# EAGLE design sound_board (EAGLE 5.10)
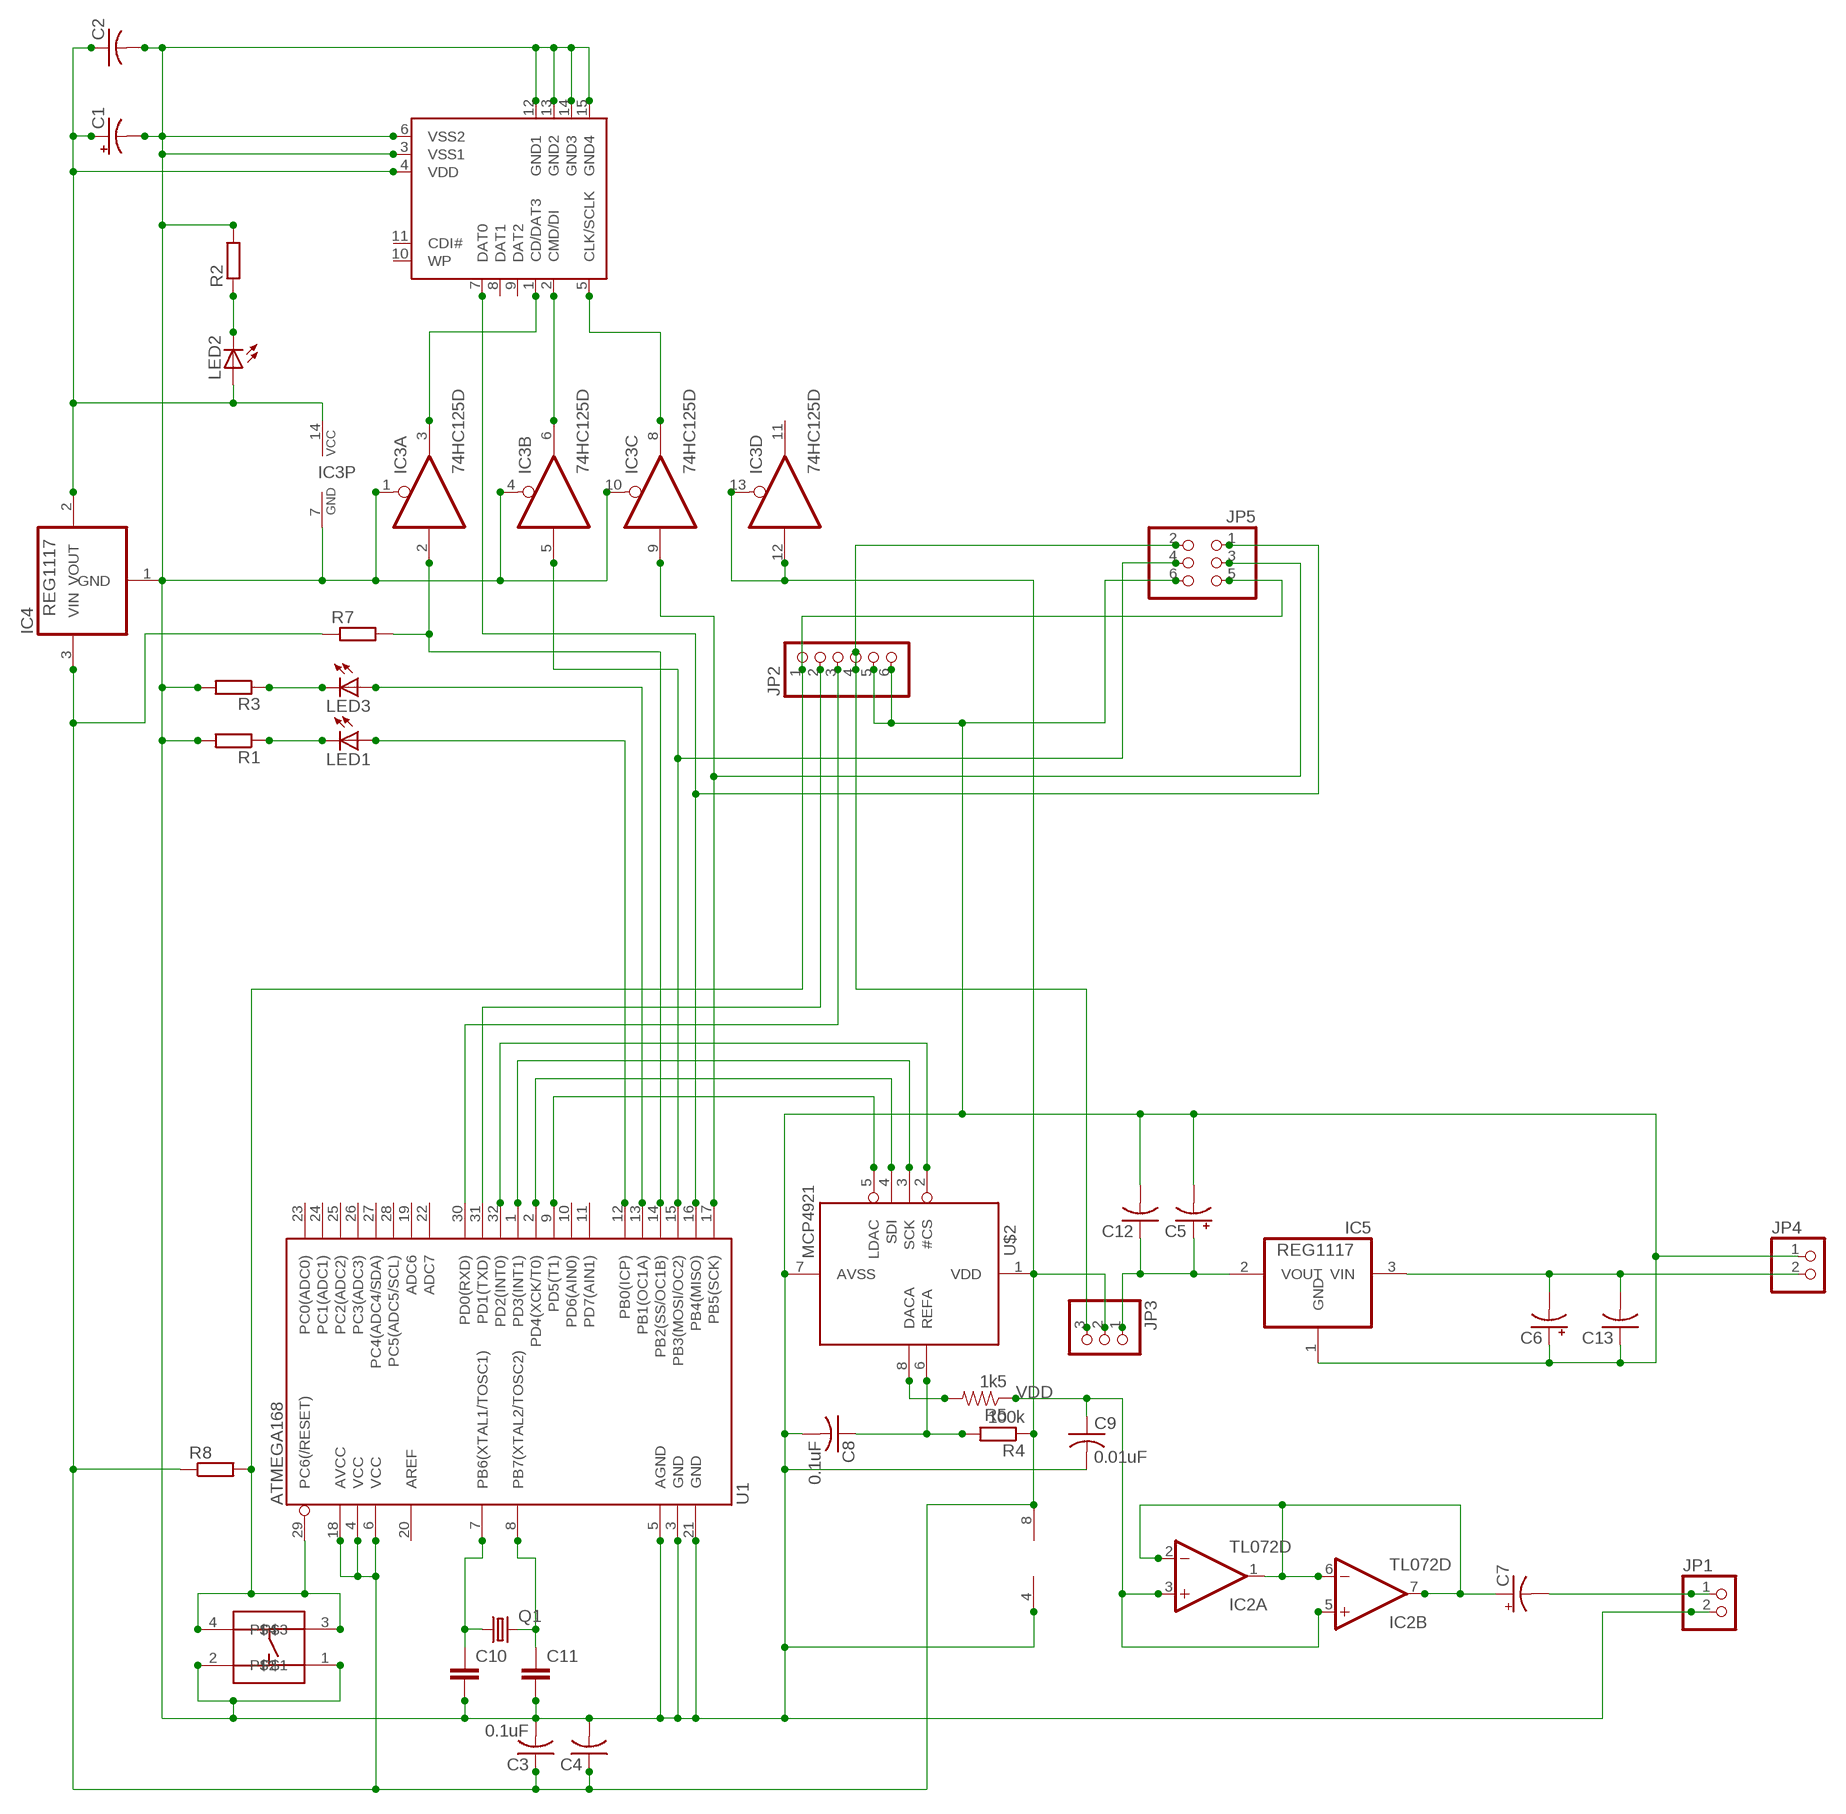
[diagram p0: schematic, sheet 1]

## Parts
C1  CPOL-US153CLV-0605  [153CLV-0605]
C2  C-USC0805  [C0805]
C3  0.1uF  C-USC0805  [C0805]
C4  C-USC0805  [C0805]
C5  CPOL-US153CLV-0605  [153CLV-0605]
C6  CPOL-US153CLV-0605  [153CLV-0605]
C7  CPOL-US153CLV-0810  [153CLV-0810]
C8  0.1uF  C-USC0805  [C0805]
C9  0.01uF  C-USC0805  [C0805]
C10  C-EUC0805  [C0805]
C11  C-EUC0805  [C0805]
C12  C-USC0805  [C0805]
C13  C-USC0805  [C0805]
IC2  TL072D  [SO08]
IC3  74HC125D  [SO14]
IC4  REG1117  [SOT223]
IC5  REG1117  [SOT223]
JP1  PINHD-1X2  [1X02]
JP2  PINHD-1X6  [1X06]
JP3  PINHD-1X3  [1X03]
JP4  PINHD-1X2  [1X02]
JP5  PINHD-2X3  [2X03]
LED1  LEDCHIP-LED0805  [CHIP-LED0805]
LED2  LEDCHIP-LED0805  [CHIP-LED0805]
LED3  LEDCHIP-LED0805  [CHIP-LED0805]
Q1  CRYSTAL10.5X4.8  [CRYSTAL-SMD-10.5X4.8-2PIN]
R1  R-EU_R0805  [R0805]
R2  R-EU_R0805  [R0805]
R3  R-EU_R0805  [R0805]
R4  100k  R-EU_R0805  [R0805]
R5  1k5  RESISTOR1206  [1206]
R7  R-EU_R0805  [R0805]
R8  R-EU_M0805  [M0805]
U1  ATMEGA168  [TQFP32-08]
U$1  SMD-TACT-SW  [SMD-TACT-SW]
U$2  MCP4921SMD  [SO08]
U$3  SD/MMCSD/MMC  [SD/MMC]

## Nets
3V3: C1.+ C2.1 IC3.14(P:VCC) IC4.2(VOUT) LED2.A U$3.4(VDD)
AVSS: C1.- C2.2 C3.2 C4.2 C5.- C6.+ C8.2 C9.2 C10.2 C11.2 C12.2 C13.1 IC2.4(P:V-) IC3.1(A:OE) IC3.4(B:OE) IC3.7(P:GND) IC3.10(C:OE) IC4.1(GND) IC5.1(GND) JP1.2 JP2.5 JP2.6 JP4.1 JP5.6 R1.2 R2.2 R3.2 U1.3(GND) U1.5(AGND) U1.21(GND) U$1.1 U$1.2 U$2.7(AVSS) U$3.3(VSS1) U$3.6(VSS2) U$3.12(GND1) U$3.13(GND2) U$3.14(GND3) U$3.15(GND4)
N$1: IC3.8(C:O) U$3.5(CLK/SCLK)
N$2: IC3.6(B:O) U$3.2(CMD/DI)
N$3: IC3.3(A:O) U$3.1(CD/DAT3)
N$5: IC3.2(A:I) R7.2 U1.14(PB2(SS/OC1B))
N$6: JP5.1 U1.16(PB4(MISO)) U$3.7(DAT0)
N$7: LED1.C R1.1
N$9: LED1.A U1.12(PB0(ICP))
N$10: JP2.3 U1.30(PD0(RXD))
N$11: C9.1 IC2.3(A:+IN) IC2.5(B:+IN) R5.1
N$12: LED2.C R2.1
N$13: C10.1 Q1.P$1 U1.7(PB6(XTAL1/TOSC1))
N$14: C7.+ IC2.1(A:OUT) IC2.2(A:-IN) IC2.6(B:-IN) IC2.7(B:OUT)
N$15: JP2.4 JP3.3 JP5.2
N$16: C7.- JP1.1
N$17: C8.1 R4.2 U$2.6(REFA)
N$18: R5.2 U$2.8(DACA)
N$19: LED3.C R3.1
N$20: IC3.5(B:I) JP5.4 U1.15(PB3(MOSI/OC2))
N$21: LED3.A U1.13(PB1(OC1A))
N$22: U1.32(PD2(INT0)) U$2.2(#CS)
N$23: U1.1(PD3(INT1)) U$2.3(SCK)
N$24: U1.2(PD4(XCK/T0)) U$2.4(SDI)
N$25: U1.9(PD5(T1)) U$2.5(LDAC)
N$26: C11.1 Q1.P$2 U1.8(PB7(XTAL2/TOSC2))
N$27: JP2.2 U1.31(PD1(TXD))
N$28: JP2.1 JP5.5 R8.2 U1.29(PC6(/RESET)) U$1.3 U$1.4
N$29: C5.+ C12.1 IC5.2(VOUT) JP3.1
N$32: IC3.9(C:I) JP5.3 U1.17(PB5(SCK))
N$41: C6.- C13.2 IC5.3(VIN) JP4.2
VDD: C3.1 C4.1 IC2.8(P:V+) IC3.12(D:I) IC3.13(D:OE) IC4.3(VIN) JP3.2 R4.1 R7.1 R8.1 U1.4(VCC) U1.6(VCC) U1.18(AVCC) U$2.1(VDD)
Unconnected: IC3.11(D:O) U1.10(PD6(AIN0)) U1.11(PD7(AIN1)) U1.19(ADC6) U1.20(AREF) U1.22(ADC7) U1.23(PC0(ADC0)) U1.24(PC1(ADC1)) U1.25(PC2(ADC2)) U1.26(PC3(ADC3)) U1.27(PC4(ADC4/SDA)) U1.28(PC5(ADC5/SCL)) U$3.8(DAT1) U$3.9(DAT2) U$3.10(WP) U$3.11(CDI#)

## Library data of the parts
C1 C5-C7 = adafruit:CPOL-US: POLARIZED CAPACITOR, American symbol
C2-C4 C8 C9 C12 C13 = adafruit:C-US: CAPACITOR, American symbol
C10 C11 = rcl:C-EU: CAPACITOR, European symbol
IC2 = linear:TL072: OP AMP
IC3 = 74xx-eu:74*125: Quad bus BUFFER, 3-state
IC4 IC5 = burr-brown:REG1117: 800mA and 1A Low Dropout (LDO) Positive Regulator 1.8V, 2.5V, 2.85V, 3.3V, 5V, and Adj
JP1 JP4 = pinhead:PINHD-1X2: PIN HEADER
JP2 = adafruit:PINHD-1X6: PIN HEADER
JP3 = adafruit:PINHD-1X3: PIN HEADER
JP5 = pinhead:PINHD-2X3: PIN HEADER
LED1-LED3 = adafruit:LED: LED OSRAM: - CHIPLED LG R971, LG N971, LY N971, LG Q971, LY Q971, LO R971, LY R971 LH N974, LH R974 LS Q976, LO Q976, LY Q976 LO Q996 - Hyper CHIPLED LW Q18S LB Q993, LB Q99A, LB R99A - SideLED LS A670, LO A670, LY A670, LG A670, LP A670 LB A673, LV A673, LT A673, LW A673 LH A674 LY A675 LS A676, LA A676, LO A676, LY A676, LW A676 LS A679, LY A679, LG A679 - Hyper Micro SIDELED® LS Y876, LA Y876, LO Y876, LY Y876 LT Y87S - SmartLED LW L88C, LW L88S LB L89C, LB L89S, LG L890 LS L89K, LO L89K, LY L89K LS L896, LA L896, LO L896, LY L896 - TOPLED LS T670, LO T670, LY T670, LG T670, LP T670 LSG T670, LSP T670, LSY T670, LOP T670, LYG T670 LG T671, LOG T671, LSG T671 LB T673, LV T673, LT T673, LW T673 LH T674 LS T676, LA T676, LO T676, LY T676, LB T676, LH T676, LSB T676, LW T676 LB T67C, LV T67C, LT T67C, LS T67K, LO T67K, LY T67K, LW E67C LS E67B, LA E67B, LO E67B, LY E67B, LB E67C, LV E67C, LT E67C LW T67C LS T679, LY T679, LG T679 LS T770, LO T770, LY T770, LG T770, LP T770 LB T773, LV T773, LT T773, LW T773 LH T774 LS E675, LA E675, LY E675, LS T675 LS T776, LA T776, LO T776, LY T776, LB T776 LHGB T686 LT T68C, LB T68C - Hyper Mini TOPLED® LB M676 - Mini TOPLED Santana® LG M470 LS M47K, LO M47K, LY M47K Source: http://www.osram.convergy.de/
Q1 = SparkFun:CRYSTAL: Crystals Various standard crystals. Proven footprints. Spark Fun Electronics SKU : COM-00534
R1-R4 R7 = resistor:R-EU_: RESISTOR, European symbol
R5 = SparkFun:RESISTOR: Resistor Basic schematic elements and footprints for 0603, 1206, and PTH 1/10th watt (small) resistors.
R8 = rcl:R-EU_: RESISTOR, European symbol
U1 = SparkFun:ATMEGA168
U$1 = jasons_stuff:SMD-TACT-SW
U$2 = jasons_stuff:MCP4921
U$3 = jasons_stuff:SD/MMC: SD card connector KINGFONT SDCMF-10915W010

## Board
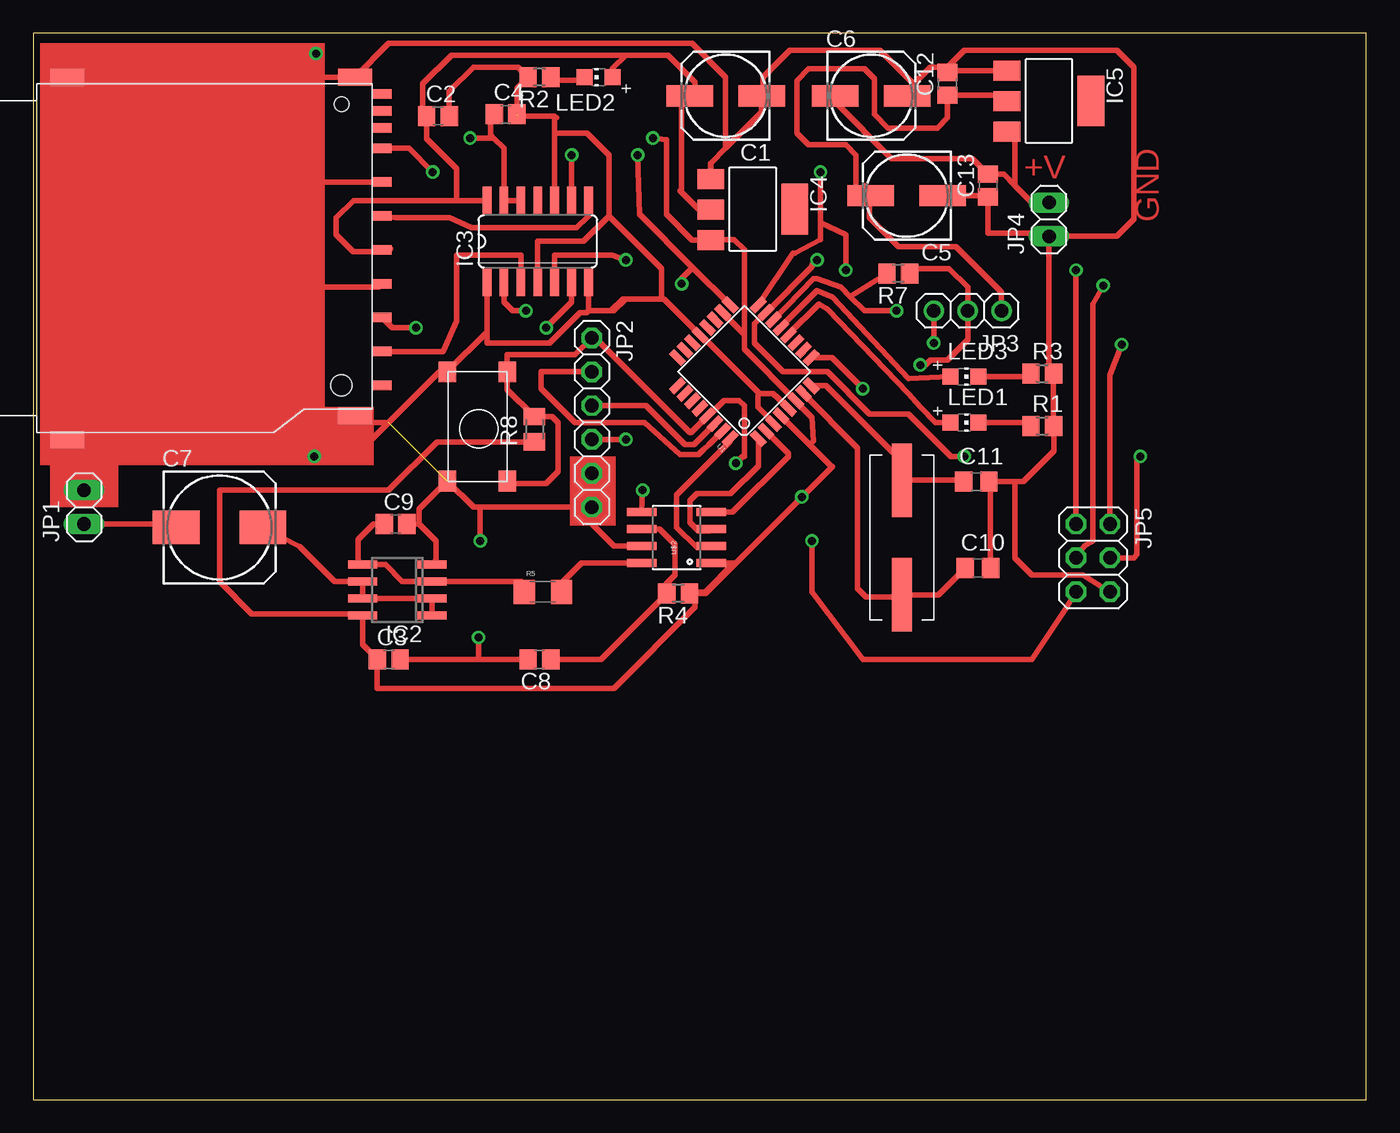
[diagram p1: board, top side]
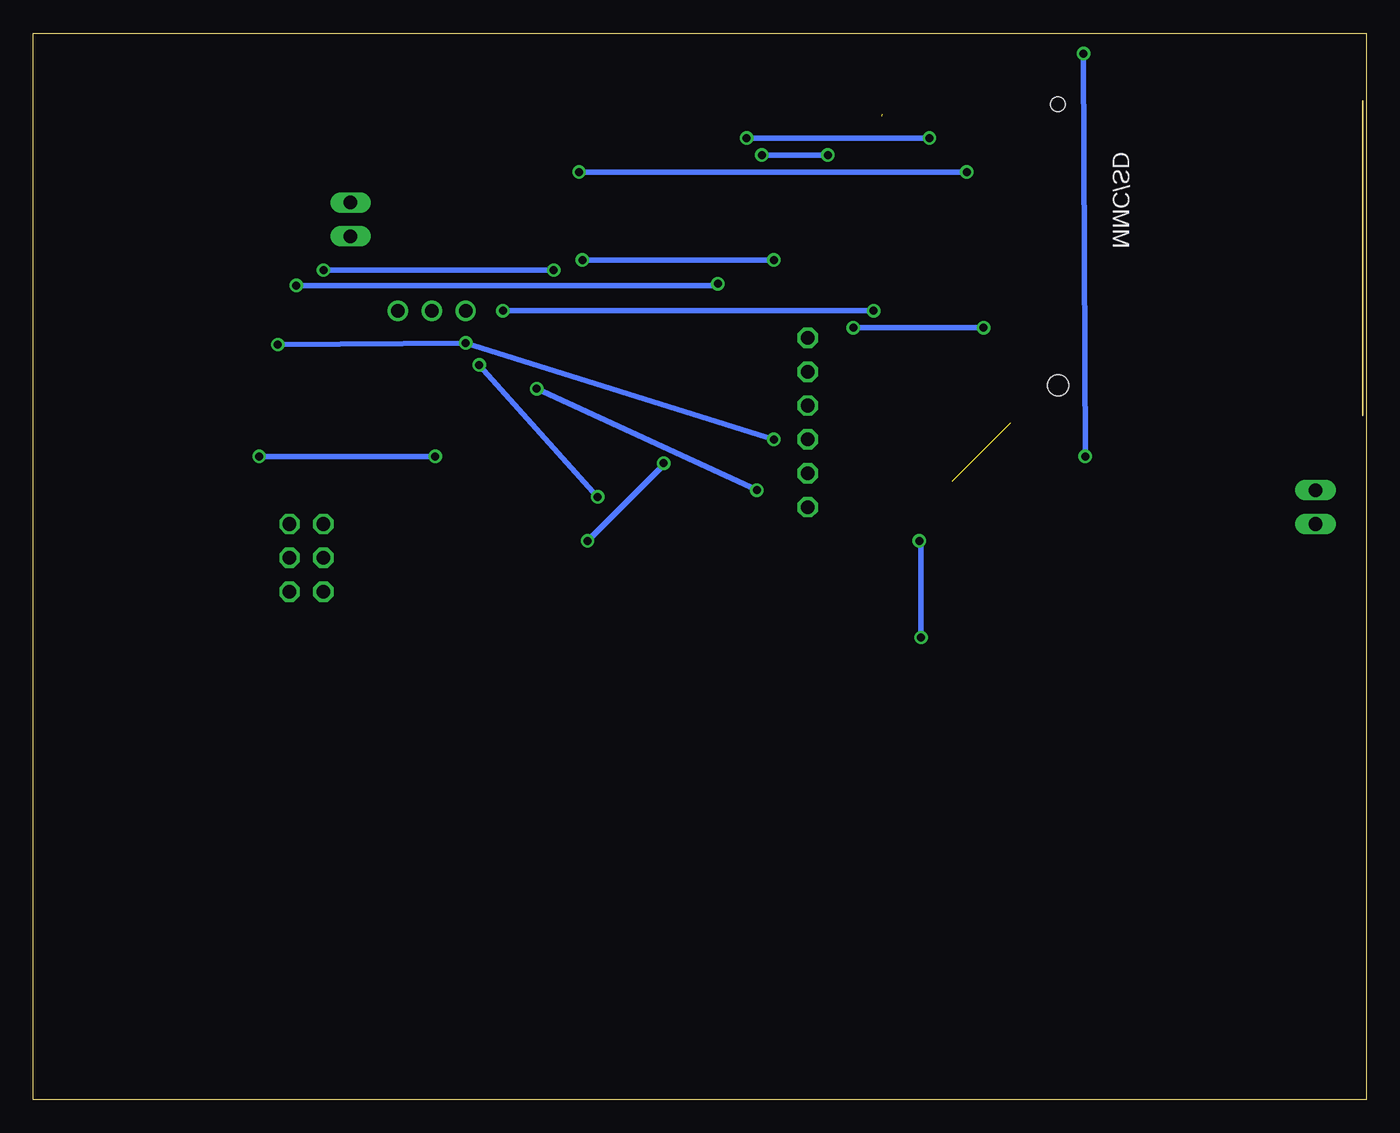
[diagram p2: board, bottom side, seen from below]

Size 100 x 80 mm. Coordinates in mm from the lower left corner, seen from the top.
Outline: 0,0 100,0 100,80 0,80 0,0
Copper layers (1*16): Top 0.035mm / dielectric 1.5mm / Bottom 0.035mm
Design rules "default": minimum track width 10mil, minimum drill 24mil, track to track 8mil, track to pad 8mil, pad to pad 8mil, via to via 8mil, smd to smd 8mil, copper to edge 40mil, drill to drill 8mil, minimum pad ring 10mil, minimum via ring 8mil, stop-mask expansion 4mil, vias tented up to drill 0mil, thermal gap 10mil

### Footprints (pad centres in the part's own frame; a part is rotated, then mirrored left to right if it is on the bottom)
153CLV-0605 = smd 3.5 x 1.6: + 2.7,0; - -2.7,0
C0805 = smd 1.3 x 1.5: 1 -0.85,0; 2 0.85,0
153CLV-0810 = smd 3.5 x 2.5: + 3.25,0; - -3.25,0
C0805' = smd 1.3 x 1.5: 1 -0.95,0; 2 0.95,0
SO08 = smd 0.6 x 2.2: 1 -1.905,-2.6; 2 -0.635,-2.6; 3 0.635,-2.6; 4 1.905,-2.6; 5 1.905,2.6; 6 0.635,2.6; 7 -0.635,2.6; 8 -1.905,2.6
SO14 = smd 0.66 x 2.032: 1 -3.81,-3.073; 2 -2.54,-3.073; 3 -1.27,-3.073; 4 0,-3.073; 5 1.27,-3.073; 6 2.54,-3.073; 7 3.81,-3.073; 8 3.81,3.073; 9 2.54,3.073; 10 1.27,3.073; 11 0,3.073; 12 -1.27,3.073; 13 -2.54,3.073; 14 -3.81,3.073
SOT223 = smd 1.499 x 2.007: 1 -2.261,-3.15; 2 0.025,-3.15; 3 2.311,-3.15 | smd 3.81 x 2.007: 4 0,3.15
1X02 = drill 1.016 long: 1 -1.27,0; 2 1.27,0
1X06 = drill 1.016 octagon: 1 -6.35,0; 2 -3.81,0; 3 -1.27,0; 4 1.27,0; 5 3.81,0; 6 6.35,0
1X03 = drill 1.016 round: 1 -2.54,0; 2 0,0; 3 2.54,0
2X03 = drill 1.016 octagon: 1 -2.54,-1.27; 2 -2.54,1.27; 3 0,-1.27; 4 0,1.27; 5 2.54,-1.27; 6 2.54,1.27
CHIP-LED0805 = smd 1.2 x 1.2: A 0,-1.05; C 0,1.05
CRYSTAL-SMD-10.5X4.8-2PIN = smd 5.5 x 1.5: P$1 -4.3,0; P$2 4.3,0
R0805 = smd 1.3 x 1.5: 1 -0.85,0; 2 0.85,0
1206 = smd 1.6 x 1.8: 1 -1.4,0; 2 1.4,0
M0805 = smd 1.3 x 1.6: 1 -0.95,0; 2 0.95,0
TQFP32-08 = smd 1.27 x 0.559: 1 -4.293,2.8; 2 -4.293,2; 3 -4.293,1.2; 4 -4.293,0.4; 5 -4.293,-0.4; 6 -4.293,-1.2; 7 -4.293,-2; 8 -4.293,-2.8; 17 4.293,-2.8; 18 4.293,-2; 19 4.293,-1.2; 20 4.293,-0.4; 21 4.293,0.4; 22 4.293,1.2; 23 4.293,2; 24 4.293,2.8 | smd 0.559 x 1.27: 9 -2.8,-4.293; 10 -2,-4.293; 11 -1.2,-4.293; 12 -0.4,-4.293; 13 0.4,-4.293; 14 1.2,-4.293; 15 2,-4.293; 16 2.8,-4.293; 25 2.8,4.293; 26 2,4.293; 27 1.2,4.293; 28 0.4,4.293; 29 -0.4,4.293; 30 -1.2,4.293; 31 -2,4.293; 32 -2.8,4.293
SMD-TACT-SW = smd 1.55 x 1.3: 1 8.2,-4.5; 2 0,-4.5; 3 8.2,0; 4 0,0
SO08' = smd 0.61 x 2.21: 1 -1.905,-2.616; 2 -0.635,-2.616; 3 0.635,-2.616; 4 1.905,-2.616; 5 1.905,2.616; 6 0.635,2.616; 7 -0.635,2.616; 8 -1.905,2.616
SD/MMC = smd 0.711 x 1.422: 1 7.366,13.462; 2 4.826,13.462; 3 2.286,13.462; 4 -0.254,13.462; 5 -2.794,13.462; 6 -5.334,13.462; 7 -7.874,13.462; 8 -9.398,13.462; 9 9.906,13.462; 10 -11.938,13.462; 11 -10.668,13.462 | smd 1.27 x 2.54: 12 12.192,11.43; 13 13.97,-10.16; 14 -13.208,-10.16; 15 -13.208,11.43 | hole 1.6: 9.906,10.414 | hole 1.1: -11.176,10.414

### Placement (x,y rotation side)
C1  51.94,75.31 180 top
C2  30.35,73.79 0 top
C3  26.67,33.02 0 top
C4  35.43,73.91 0 top
C5  65.53,67.82 180 top
C6  62.87,75.31 0 top
C7  13.97,42.93 0 top
C8  37.97,33.02 180 top
C9  27.18,43.18 0 top
C10  [C0805']  70.87,39.88 0 top
C11  [C0805']  70.74,46.35 0 top
C12  68.58,76.2 90 top
C13  71.63,68.58 90 top
IC2  27.3,38.23 90 top
IC3  37.85,64.39 0 top
IC4  53.98,66.8 270 top
IC5  76.2,74.93 270 top
JP1  3.81,44.45 90 top
JP2  41.91,50.8 270 top
JP3  70.1,59.18 180 top
JP4  76.2,66.04 90 top
JP5  79.5,40.64 270 top
LED1  69.85,50.8 270 top
LED2  42.42,76.71 90 top
LED3  69.85,54.23 270 top
Q1  65.15,42.16 90 top
R1  75.69,50.55 0 top
R2  37.97,76.71 180 top
R3  75.69,54.48 0 top
R4  48.39,37.97 180 top
R5  38.23,38.1 0 top
R7  64.9,61.98 180 top
R8  37.59,50.29 90 top
U1  53.34,54.61 135 top
U$1  35.56,54.61 270 top
U$2  MCP4921SMD  [SO08']  48.26,42.16 90 top
U$3  12.7,63.5 270 top

### Tracks (layer width: path | path; a pad name or v marks a point on that pad's centre or on a via)
3V3
  Top 0.406: IC4.2 50.8,66.8 49.91,66.8 48.51,68.2 48.64,68.33 48.64,74.93 49.02,75.31 C1.+ 49.66,75.72 49.66,76.33 47.62,78.36 44.45,78.36 | U$3.4 26.25,63.84 26.8,63.84 26.58,63.63 24,63.63 22.73,64.9 22.73,66.17 24.03,67.46 31.75,67.46 | 44.45,78.36 31.37,78.36 29.21,76.2 29.21,74.08 C2.1 29.5,72.1 31.75,69.85 31.75,67.46 | LED2.A 43.47,77.38 44.45,78.36 | 31.75,67.46 IC3.14
AVSS  (via drill 0.6 pad 0.81)  (2 unrouted)
  Top 0.406: R1.2 76.58,50.51 76.58,48.64 74.3,46.35 73.66,46.35 | R1.2 R3.2 76.2,54.83 JP4.1 | JP2.6 JP2.5 | JP2.6 41.91,43.18 43.56,41.53 U$2.7 | 28.96,43.18 C9.2 | 28.96,43.18 30.23,41.91 30.23,40.45 IC2.4 | 28.96,43.18 28.96,44.31 U$1.1 33.02,44.45 33.53,44.45 | 33.53,44.45 JP2.6 | C3.2 33.4,33.02 | 33.4,33.02 C8.2 | 33.4,33.02 v33.4,34.67 | v33.53,41.91 33.53,44.45 | 18.67,50.93 23.24,50.8 U$3.12 24.64,50.8 | IC5.1 68.72,77.19 C12.2 | C12.2 68.58,77.47 69.85,78.74 81.28,78.74 82.55,77.47 82.55,66.04 81.28,64.77 JP4.1 | 34.04,57.59 34.04,56.77 38.73,56.77 41.02,59.05 41.53,59.05 41.66,59.18 | 34.04,57.59 IC3.1 | 34.04,57.59 U$1.2 30.48,54.61 26.67,50.8 | 41.66,59.18 43.31,59.18 | 43.31,59.18 44.2,60.07 44.45,60.07 | 46.99,60.07 47.31,60.07 U1.21 50.08,57.36 54.48,52.96 | 21.21,76.71 19.18,74.93 17.78,74.93 | 21.21,76.71 U$3.15 26.67,79.25 49.4,79.25 51.94,76.71 51.94,71.37 | 26.67,50.8 24.64,50.8 | 24.64,50.8 18.67,50.93 | 18.67,50.93 18.67,60.96 25.91,60.96 U$3.3 | U$3.14 3.3,76.71 5.08,74.93 17.78,74.93 | U$3.6 19.81,68.83 17.91,69.47 17.91,74.8 17.78,74.93 | v21.21,78.49 21.21,76.71 | 54.48,52.96 55.5,52.96 55.63,52.83 55.68,52.83 U1.5 | U1.3 55.53,50.77 54.36,51.94 54.36,52.83 54.48,52.96 | C2.2 31.2,75.65 33.02,77.47 36.36,77.47 R2.2 36.28,75.87 C4.2 | 39.12,73.79 36.32,73.79 | 39.12,73.79 39.24,73.66 | IC3.4 37.85,64.39 41.27,64.39 43.18,66.29 | 39.12,72.52 IC3.10 | 39.12,72.52 39.12,73.79 | 39.12,72.52 41.53,72.52 43.18,70.87 43.18,66.29 | 41.66,59.18 IC3.7 | 43.31,59.18 43.56,59.18 44.45,60.07 | 44.45,60.07 46.99,60.07 | 46.99,60.07 47.12,60.2 47.12,62.36 43.18,66.29 | C10.2 71.82,46.23 C11.2 73.66,46.35
  Top 0.406: JP4.1 75.95,65.02 71.63,65.02 C13.1 70.91,67.82 C5.- | 26.67,50.8 24.13,48.26 v21.08,48.26 5.84,48.26 JP1.2 2.54,46.99 U$3.13 | R1.2 76.8,50.8 | JP5.6 78.74,39.37 74.93,39.37 73.66,40.64 73.66,46.35 | 66.04,75.79 66.04,74.93 | 66.04,75.79 66.04,76.2 63.5,78.74 56.77,78.74 54.74,76.71 54.74,75.41 C1.- 54.64,74.07 51.94,71.37 | 66.04,75.79 C6.+ 65.56,75.72 67.31,77.47 68.16,77.47 C12.2 | 50.83,70.26 50.8,70.23 50.8,69.09 IC4.1 50.83,70.26 | 51.94,71.37 50.83,70.26
  Bottom 0.406: v33.4,34.67 33.4,41.78 v33.53,41.91 | v21.08,48.26 v21.21,78.49
N$1
  Top 0.406: IC3.8 41.66,66.29 40.77,65.41 32.89,65.41 31.24,66.17 27.18,66.17 U$3.5
N$2  (via drill 0.6 pad 0.81)
  Top 0.406: IC3.6 40.39,59.82 v38.48,57.91 | v28.7,57.91 26.92,57.91 U$3.2
  Bottom 0.406: v28.7,57.91 v38.48,57.91
N$3
  Top 0.406: IC3.3 36.58,63.37 31.75,63.37 31.75,58.42 30.73,56.13 U$3.1
N$5  (via drill 0.6)
  Top 0.406: IC3.2 35.31,59.82 35.94,59.18 v36.96,59.18 | v64.77,59.18 62.36,59.18 61.28,60.26 | 61.28,60.26 60.58,60.96 58.8,61.59 58.55,61.59 U1.14 | 61.28,60.26 R7.2
  Bottom 0.406: v36.96,59.18 v64.77,59.18
N$6  (via drill 0.6, 0.6 pad 0.81)
  Top 0.406: U$3.7 28.19,71.37 v29.97,69.6 | v59.05,69.6 59.05,65.79 | 59.05,65.79 59.05,64.52 57.15,63.5 57,63.5 U1.16 | v60.96,62.23 60.96,64.9 59.05,65.79 | v78.23,62.23 JP5.1
  Bottom 0.406: v29.97,69.6 v59.05,69.6 | v60.96,62.23 v78.23,62.23
N$7
  Top 0.406: LED1.C 74.59,50.8 R1.1
N$9
  Top 0.406: LED1.A 67.69,50.8 66.55,51.94 65.66,52.96 59.56,59.31 58.93,59.69 56.66,57.42 U1.12
N$10
  Top 0.406: JP2.3 45.97,52.07 48.9,49.15 49.58,49.15 U1.30
N$11
  Top 0.406: R5.1 36.62,38.86 IC2.3 27.69,38.86 26.42,40.13 IC2.5 24.38,40.45 24.38,42.04 25.53,43.18 C9.1
N$12
  Top 0.406: R2.1 39.04,76.49 41.15,76.49 LED2.C
N$13
  Top 0.406: U1.7 57.79,52.95 61.85,48.9 61.85,38.35 62.48,37.72 65.01,37.72 Q1.P$1 67.9,37.86 C10.1
N$14
  Top 0.406: C7.+ 19.98,41.49 22.61,38.86 IC2.6 IC2.7 IC2.2 IC2.1
N$15  (via drill 0.6, 0.6 pad 0.81)
  Top 0.406: JP2.4 v44.45,49.53 | v67.56,56.77 JP3.3 | JP5.2 80.77,54.36 v81.66,56.64
  Bottom 0.406: v44.45,49.53 v67.56,56.77 v81.66,56.64
N$16
  Top 0.406: JP1.1 11.52,43.18 C7.-
N$17
  Top 0.406: C8.1 42.58,33.02 R4.2 47.5,38.01 47.5,38.73 48.13,39.37 48.13,41.66 46.99,42.8 U$2.6
N$18
  Top 0.406: R5.2 39.08,38.19 41.15,40.26 U$2.8
N$19
  Top 0.406: LED3.C 74.59,54.23 R3.1
N$20  (via drill 0.6)
  Top 0.406: IC3.5 39.12,63.37 43.43,63.37 v44.45,62.99 | v69.85,48.26 68.83,48.26 65.66,51.44 62.74,51.44 59.56,54.61 56.26,54.61 54.1,56.77 54.1,58.2 U1.15 54.99,59.06 58.42,62.48 58.42,62.61 v58.8,62.99 | JP5.4 82.55,40.64 82.8,40.89 82.8,48.01 v83.06,48.26
  Bottom 0.406: v44.45,62.99 v58.8,62.99 | v69.85,48.26 v83.06,48.26
N$21
  Top 0.406: U1.13 56.15,57.93 56.15,58.05 58.8,60.71 59.94,60.2 65.66,54.1 LED3.A
N$22
  Top 0.406: U$2.2 50.75,41.4 49.78,41.4 48.26,42.93 48.26,45.34 52.28,49.36 U1.32
N$23
  Top 0.406: U1.1 54.4,47.54 52.32,45.47 49.78,45.47 49.28,44.96 49.28,43.31 49.91,42.67 50.75,42.67 U$2.3
N$24
  Top 0.406: U$2.4 52.45,44.07 56.64,48.26 56.64,48.48 U1.2
N$25  (via drill 0.6 pad 0.81)
  Top 0.406: U1.9 59.91,55.66 v62.23,53.34 | U$2.5 v45.72,45.72
  Bottom 0.406: v45.72,45.72 v62.23,53.34
N$26
  Top 0.406: U1.8 59.48,53.55 65.28,47.75 65.28,46.59 Q1.P$2 69.68,46.46 C11.1
N$27
  Top 0.406: 41.27,54.61 JP2.2 38.1,54.61 38.1,53.34 40.64,50.8 45.85,50.8 48.51,48.39 49.91,48.39 50.29,48.77 50.67,49.12 U1.31
N$28  (via drill 0.6)
  Top 0.406: U$1.3 35.74,46.23 38.48,46.23 39.37,47.12 39.37,50.8 38.93,51.24 R8.2 35.56,53.27 U$1.4 35.56,55.88 40.64,55.88 JP2.1 42.16,57.15 49.28,50.04 49.33,50.04 U1.29 50.66,51.29 51.82,52.45 52.96,52.45 53.34,52.07 53.34,48.26 53.21,48.26 v52.7,47.75 | v58.42,41.91 58.42,38.1 62.23,33.02 74.93,33.02 77.47,36.83 JP5.5
  Bottom 0.406: v52.7,47.75 52.7,47.62 v58.42,41.91
N$29
  Top 0.406: IC5.2 72.61,75.35 C12.1 68.58,73.66 67.82,72.9 64.14,72.9 63.12,73.91 63.12,76.58 62.36,77.34 58.17,77.34 57.28,76.45 57.28,72.52 58.17,71.63 60.96,71.63 61.72,70.87 61.72,67.94 61.47,67.69 61.98,67.69 62.47,68.18 | 62.36,68.58 62.36,68.29 62.47,68.18 | 62.47,68.18 C5.+ 62.74,67.72 62.74,66.17 64.9,64.01 69.22,64.01 72.64,60.58 JP3.1
N$32  (via drill 0.6, 0.6 pad 0.81)
  Top 0.406: U1.17 52.26,59.62 49.47,62.42 | 49.47,62.42 45.47,66.42 v45.34,70.87 | IC3.9 v40.39,70.87 | JP5.3 78.87,41.53 79.5,41.91 79.5,59.69 v80.26,61.09 | v48.64,61.21 48.64,61.59 49.47,62.42
  Bottom 0.406: v40.39,70.87 v45.34,70.87 | v80.26,61.09 48.77,61.09 v48.64,61.21
N$41
  Top 0.406: JP4.2 74.93,67.31 73.66,68.58 | 73.66,68.58 73.66,72.01 IC5.3 72.94,72.73 | 73.66,68.58 72.81,69.43 C13.2 70.45,70.61 64.39,70.61 60.16,74.84 C6.-
VDD  (via drill 0.6 pad 0.81)
  Top 0.406: 52.7,40.26 52.58,40.26 | 58.26,49.12 59.89,47.5 59.94,47.5 v57.66,45.21 52.7,40.26 | 58.26,49.12 U1.4 | 49.66,37.97 R4.1 | 49.66,37.97 50.42,37.97 52.7,40.26 | IC3.12 IC3.13 35.31,71.37 34.54,72.14 | U1.18 51.72,59.02 53.34,57.4 | 53.34,57.4 53.34,63.75 52.58,64.52 50.85,64.52 IC4.3 49.43,64.49 47.5,66.42 47.5,72.01 v46.48,72.14 | 53.34,57.4 53.34,56.31 U1.6 57.22,52.38 58.42,51.18 58.55,49.4 58.26,49.12 | 34.54,72.14 34.29,72.39 34.29,73.62 C4.1 | v32.77,72.14 34.54,72.14 | R8.1 30.29,49.34 26.67,45.72 13.97,45.72 13.97,38.86 16.38,36.45 24.58,36.45 IC2.8 24.7,34.13 C3.1 25.78,32.98 25.78,30.86 43.56,30.86 49.66,36.96 49.66,37.97 | 52.58,40.26 U$2.1 | 52.58,40.26 50.42,38.1 49.78,38.1 49.66,37.97 | R7.1 65.49,62.36 68.71,62.36 70.1,60.96 JP3.2 70.1,57.02 68.58,55.5 67.31,55.5 66.93,55.12 v66.55,55.12
  Bottom 0.406: v46.48,72.14 v32.77,72.14 | v57.66,45.21 v66.55,55.12
(copper drawn outside any net)
  shapes: Top area x4

### Text on the board
Top: +V | GND